# EasyEDA schematic lane_terminal.json
TITLE: Sheet_1; REV: 1.0; Date: 2022-01-30; Sheet: 1/1; Company: Your Company
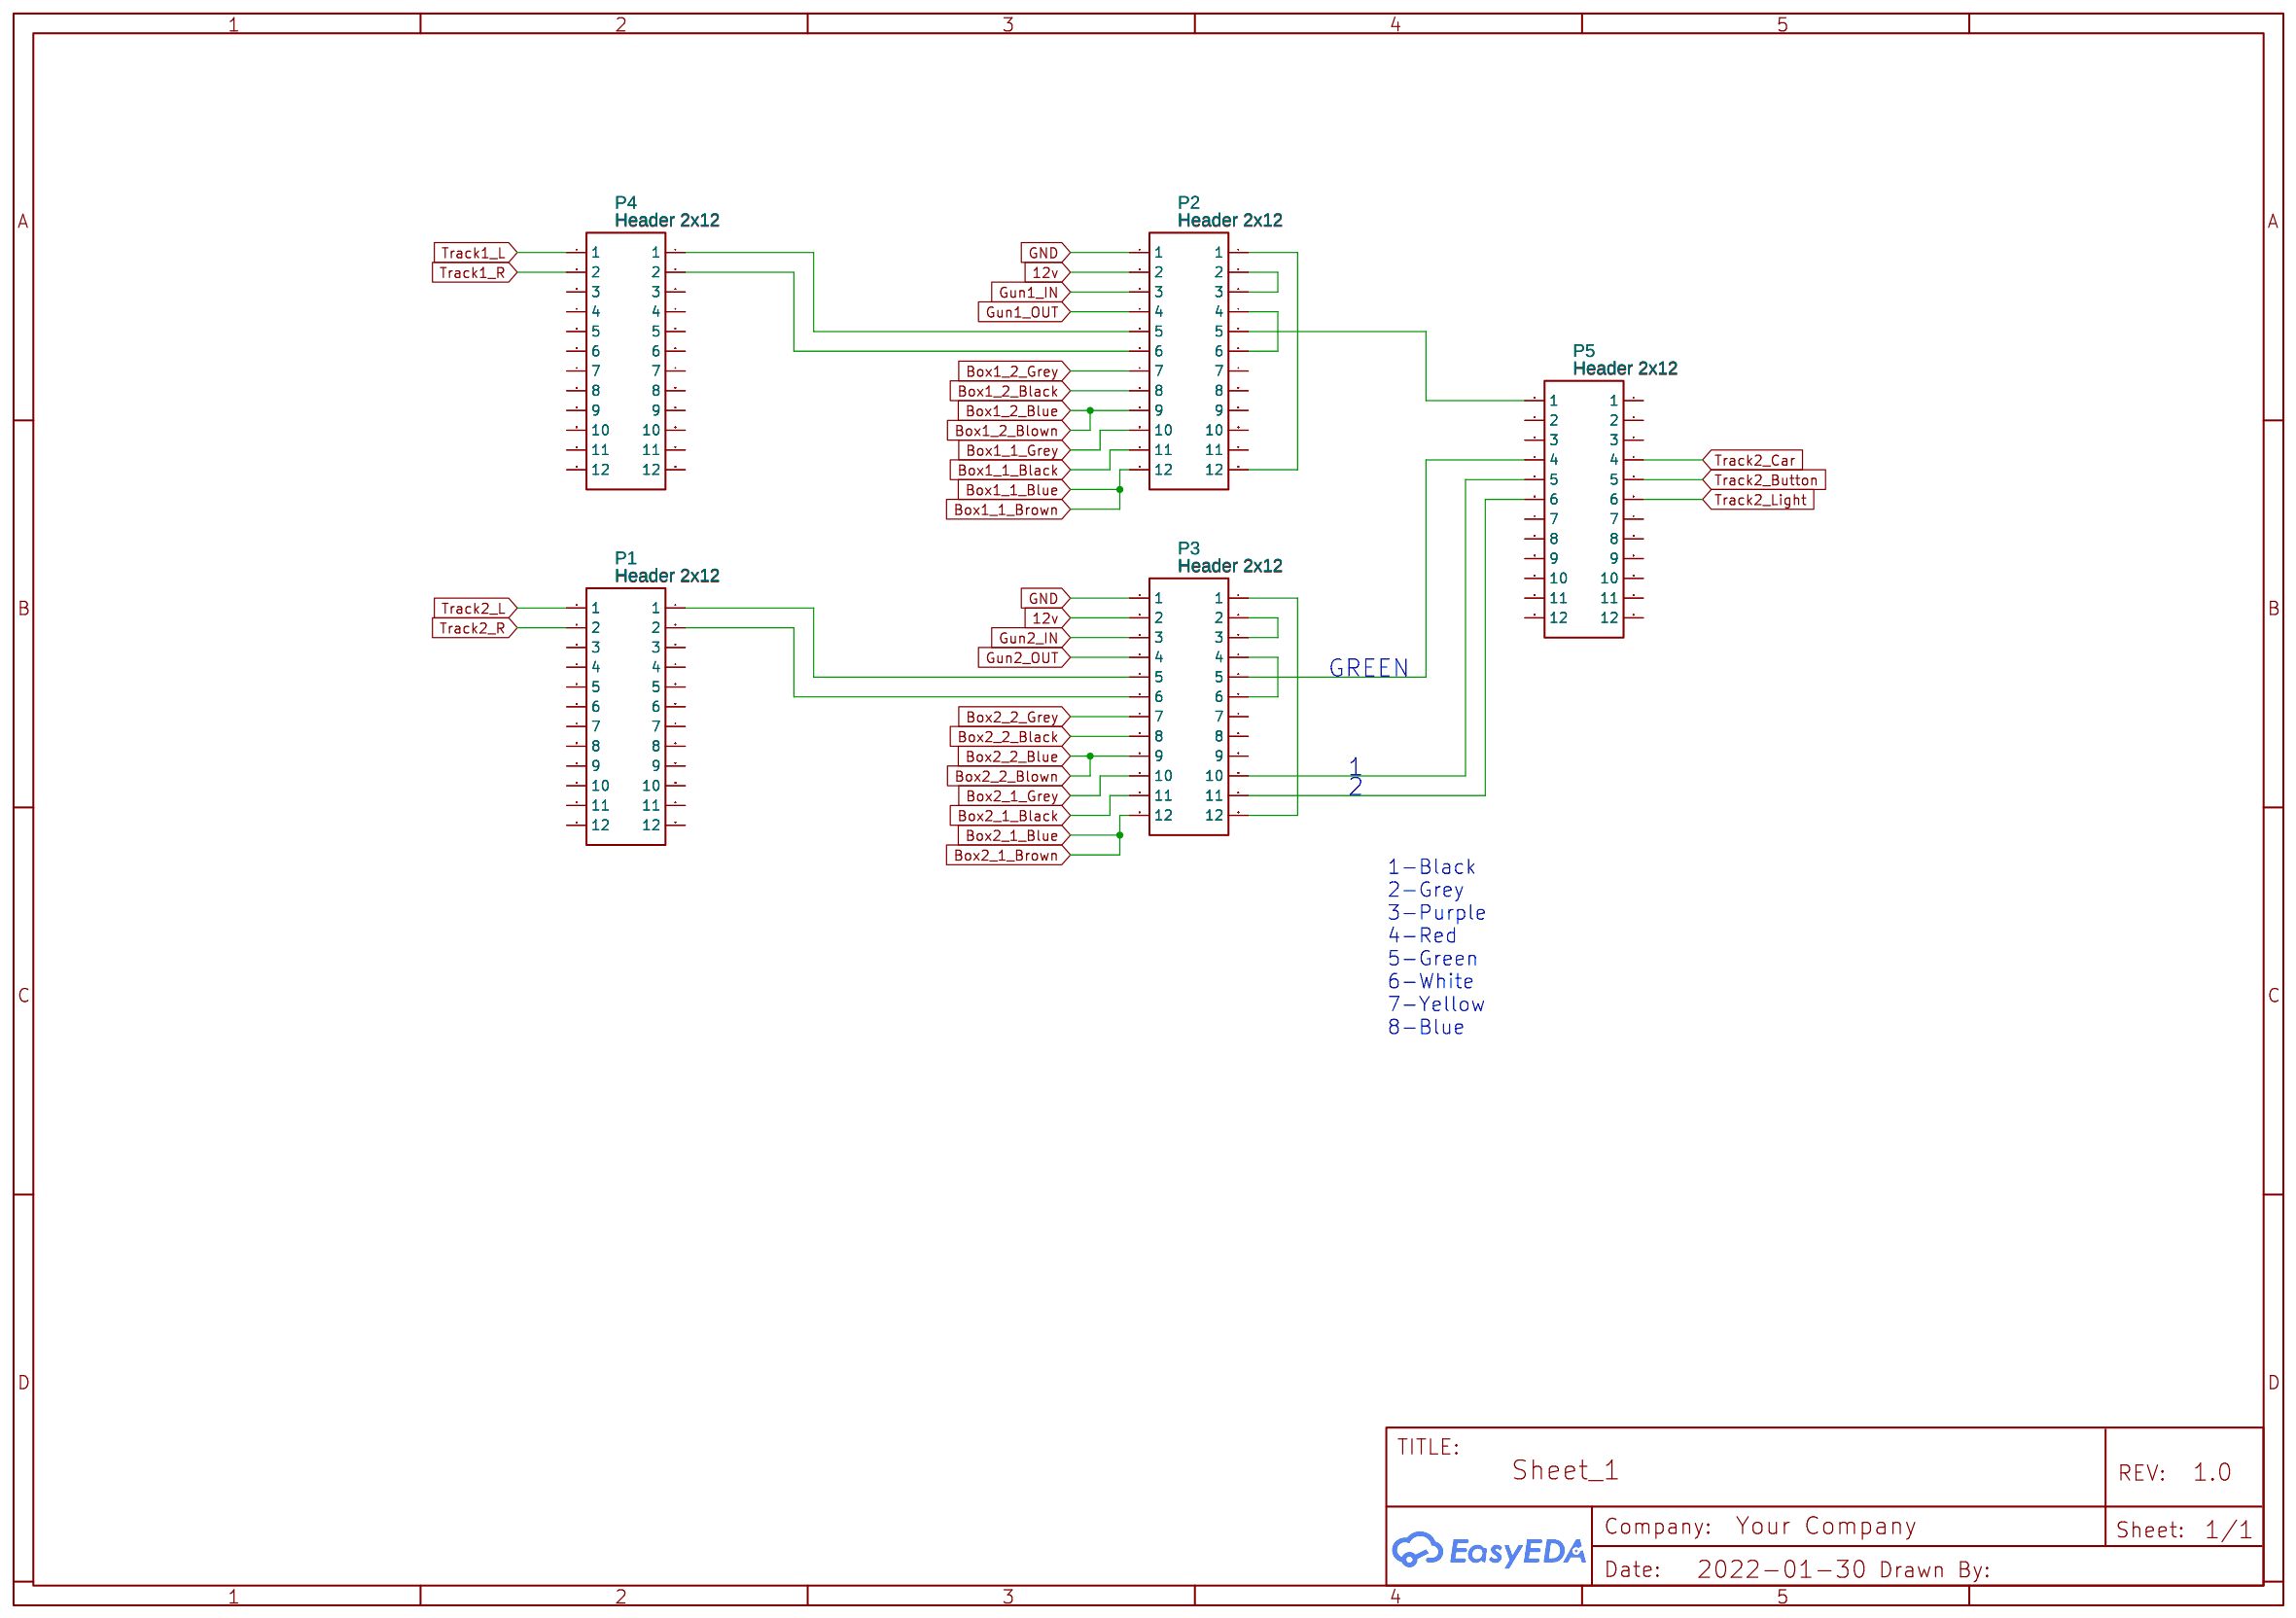
[diagram p0: schematic sheet]

## Parts
P1  Header 2x12  [HEADER-2X12]
P2  Header 2x12  [HEADER-2X12]
P3  Header 2x12  [HEADER-2X12]
P4  Header 2x12  [HEADER-2X12]
P5  Header 2x12  [HEADER-2X12]

## Library data of the parts
P1-P5 = Header 2x12: Contributor: sohaibpannu

## Nets
12v: P2.2 P2.3 P3.2 P3.3
Box1_1_Black: P2.11
Box1_1_Blue: P2.1 P2.12 P3.1 P3.12
Box1_1_Grey: P2.10
Box1_2_Black: P2.8
Box1_2_Blown: P2.9
Box1_2_Grey: P2.7
Box2_1_Black: P3.11 P5.6
Box2_1_Grey: P3.10 P5.5
Box2_2_Black: P3.8
Box2_2_Blown: P3.9
Box2_2_Grey: P3.7
Gun1_OUT: P2.4 P2.6 P4.2
Gun2_OUT: P1.2 P3.4 P3.6
Track1_L: P2.5 P4.1 P5.1
Track2_Car: P1.1 P3.5 P5.4

Not connected (* = marked no-connect by the designer): P1 3 4 5 6 7 8 9 10 11 12; P4 3 4 5 6 7 8 9 10 11 12; P5 2 3 7 8 9 10 11 12

## Notes on the sheet
- GREEN
- 1
- 2
- 1-Black
  2-Grey
  3-Purple
  4-Red
  5-Green
  6-White
  7-Yellow
  8-Blue
